# Altium schematic sheet Qwiic_Pocket_Dev_ESP32_C6.SchDoc: Qwiic_Pocket_Dev_ESP32_C6
size 273 x 224 mm; Origin: Eagle; OriginPath: D:\_Studies\2025\Skripsie\Altium\Imports\Qwiic_Pocket_Dev_ESP32_C6.sch; OriginSheet: 1; Date: 2023/09/21 16:52:52; SheetNumber: 1; DESIGNER: Dryw Wade; REV: v10; GateName_1: G$1; SymbolName_1: FRAME-LETTER; LibraryName: SparkFun-Aesthetics; DeviceSetName: FRAME-LETTER; GateName_2: V; SymbolName_2: DOCFIELD; Sheet: Sheet:; ReleasedundertheCreativeCommons: Released under the Creative Commons; AttributionShare-Alike4.0License: Attribution Share-Alike 4.0 License; https://creativecommons.org/licenses/by-sa/4.0/: https://creativecommons.org/licenses/by-sa/4.0/; Designby: Design by:
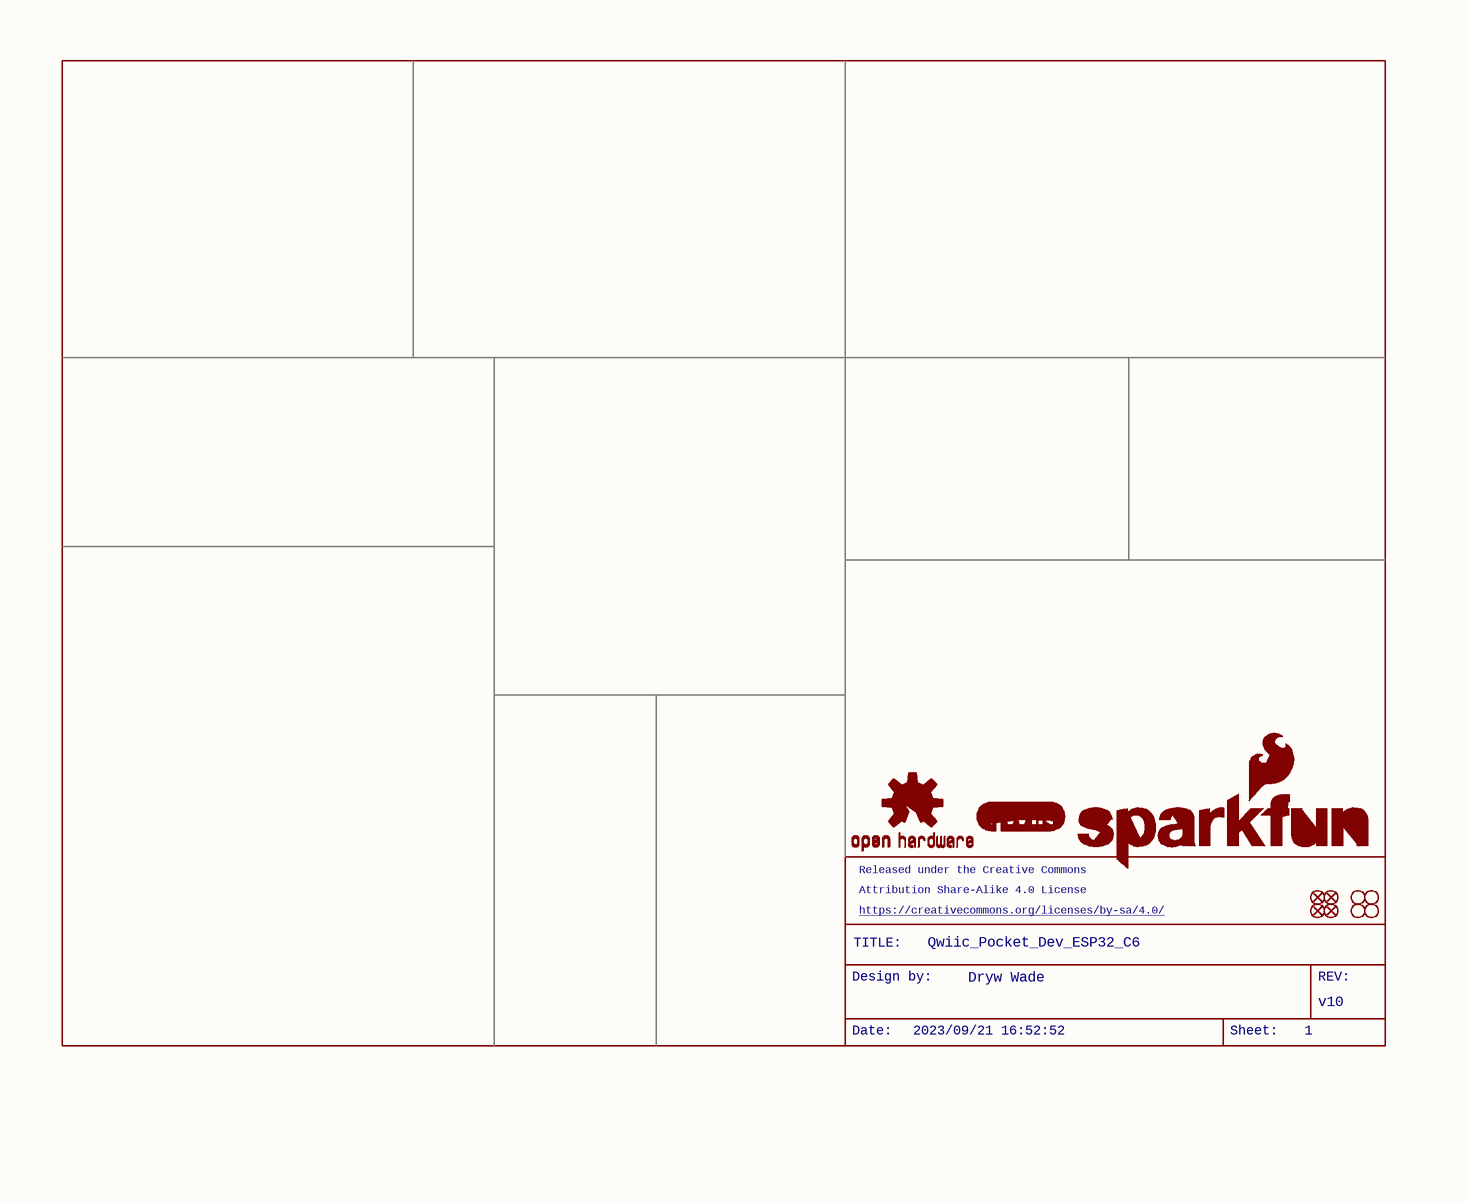
[diagram p0: Qwiic_Pocket_Dev_ESP32_C6.SchDoc]

## Parts
FD1  FIDUCIALUFIDUCIAL  [FIDUCIAL-MICRO]  (value not drawn)
FD2  FIDUCIALUFIDUCIAL  [FIDUCIAL-MICRO]  (value not drawn)
FD3  FIDUCIALUFIDUCIAL  [FIDUCIAL-MICRO]  (value not drawn)
FD4  FIDUCIALUFIDUCIAL  [FIDUCIAL-MICRO]  (value not drawn)
H1  STAND-OFF  [STAND-OFF]  (value not drawn)
H2  STAND-OFF  [STAND-OFF]  (value not drawn)
H3  STAND-OFF  [STAND-OFF]  (value not drawn)
H4  STAND-OFF  [STAND-OFF]  (value not drawn)
LOGO1  SFE_LOGO_NAME_FLAMEBLANK  [BLANK]  (value not drawn)
LOGO2  OSHW-LOGOS  [OSHW-LOGO-S]  (value not drawn)
LOGO3  QWIIC_LOGO_3MM  [QWIIC_3MM]  (value not drawn)

## Notes on the sheet
- (near LOGO1) Released under the Creative Commons
- TITLE:
- (near LOGO1) Attribution Share-Alike 4.0 License
- (near LOGO1) https://creativecommons.org/licenses/by-sa/4.0/
- Qwiic_Pocket_Dev_ESP32_C6
- Design by:
- Dryw Wade
- REV:
- v10
- Date:
- 2023/09/21 16:52:52
- Sheet:
- 1

## Library data of the parts
FD1-FD4 = FIDUCIALUFIDUCIAL: Fiducial Alignment Points    Point-of-reference for pick-and-place machines and other optical instruments.; GateName_1: G$1; SymbolName_1: FIDUCIAL; DeviceName: UFIDUCIAL; LibraryName: SparkFun-Aesthetics; DeviceSetName: FIDUCIAL
H1-H4 = STAND-OFF: Stand Off    Drill holes for mechanically mounting via screws, standoffs, etc.   Note: Use the keepout ring to avoid running the screw head into surrounding components.  Variant Overviews  STAND-OFF - Mechanical footprint for a #4 phillips button head screw.  STAND-OFF-TIGHT - Mechanical footprint for a #4 phillips button head screw,      Example SparkFun Products  Screw - Phillips Head (1/4", 4-40, 10 pack) (PRT-10453)  Screw - Phillips Head (1/2", 4-40, 10 pack) (PRT-10452)  Screw - Phillips Head (3/4", 4-40, 10 pack) (PRT-10451)  Screw - Phillips Head (1", 4-40, 10 pack) (PRT-10450); GateName_1: G$1; SymbolName_1: STAND-OFF; LibraryName: SparkFun-Hardware; DeviceSetName: STAND-OFF
LOGO1 = SFE_LOGO_NAME_FLAMEBLANK: SparkFun Font Logo w/ Flame    This is the SparkFun full logo. The logo on the schematic will always be the same size; the package variant is the height of the flame part of the logo. Default layer for the logo on the board is tSilk.; GateName_1: G$1; SymbolName_1: SFE_LOGO_NAME_FLAME; DeviceName: BLANK; LibraryName: SparkFun-Aesthetics; DeviceSetName: SFE_LOGO_NAME_FLAME
LOGO2 = OSHW-LOGOS: Open-Source Hardware (OSHW) Logo     This logo indicates the piece of hardware it is found on incorporates a OSHW license and/or adheres to the definition of open source hardware found here: http://freedomdefined.org/OSHW; GateName_1: G$1; DeviceName: S; SymbolName_1: OSHW-LOGO; LibraryName: SparkFun-Aesthetics; DeviceSetName: OSHW-LOGO
LOGO3 = QWIIC_LOGO_3MM: Qwiic Logos for placement on schematic and PCB. The 5.5mm silk logo is best for placing next to Qwiic connector.; GateName_1: G$1; DeviceName: _3MM; SymbolName_1: LOGO; LibraryName: SparkFun-Aesthetics; DeviceSetName: QWIIC_LOGO